# EAGLE design KLD35176BVIC_Panel_Test_Board (EAGLE 9.6.1)

## Sheet 1 of 3: LCD Circuitry
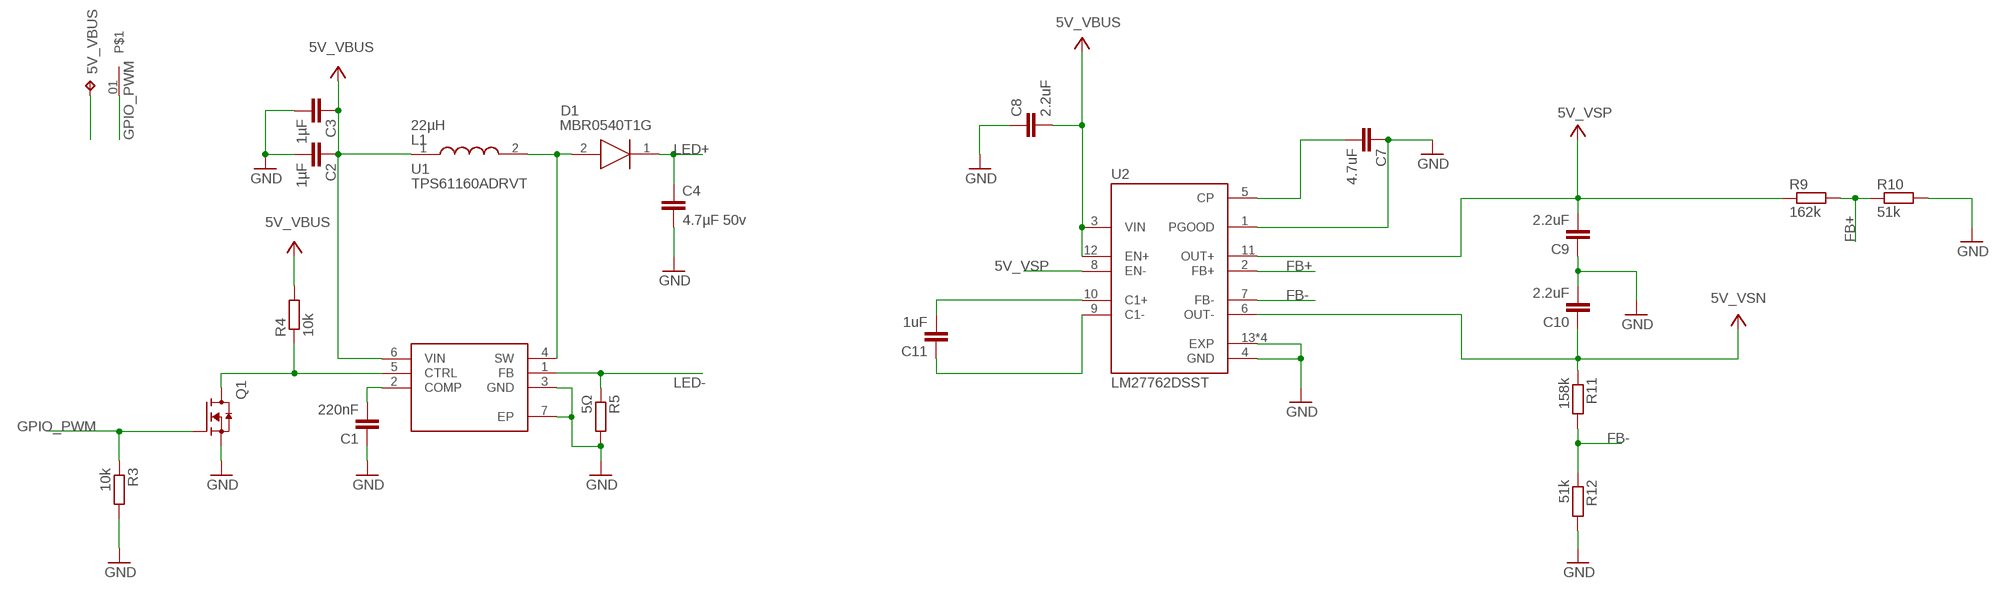
[diagram p0: schematic, sheet 1]

### Parts
5V_VBUS  TPTP19R  [TP19R]
C1  220nF  C-EUC0603  [C0603]
C2  1µF  C-EUC0603  [C0603]
C3  1µF  C-EUC0603  [C0603]
C4  4.7µF 50v  C-EUC0805  [C0805]
C7  4.7uF  C-EUC0603  [C0603]
C8  2.2uF  C-EUC0603  [C0603]
C9  2.2uF  C-EUC0603  [C0603]
C10  2.2uF  C-EUC0603  [C0603]
C11  1uF  C-EUC0603  [C0603]
D1  MBR0540T1G  [SOD3716X135N]
L1  22µH  VLCF4020T-220MR56  [VLCF4020_1]
Q1  AO3400A  [SOT95P280X125-3N]
R3  10k  R-EU_R0603  [R0603]
R4  10k  R-EU_R0603  [R0603]
R5  5Ω  R-EU_R0603  [R0603]
R9  162k  R-EU_R0603  [R0603]
R10  51k  R-EU_R0603  [R0603]
R11  158k  R-EU_R0603  [R0603]
R12  51k  R-EU_R0603  [R0603]
U1  TPS61160ADRVT  [SON65P200X200X80-7N]
U2  LM27762DSST  [IC_LM27762DSST]
U$1  PAD  [AMPHENOL_10129381-908001BLF]

### Nets
5V_VBUS: 5V_VBUS.TP C2.1 C3.1 C8.2 L1.1 R4.2 U1.6(VIN) U2.3(VIN) U2.12(EN+) ; supply symbol labelled +5V ; also sheet 3
5V_VSN: C10.1 R11.1 U2.6(OUT-) ; supply symbol labelled +5V ; also sheet 2
5V_VSP: C9.2 R9.1 U2.8(EN-) U2.11(OUT+) ; supply symbol labelled +5V ; also sheet 2
FB+: R9.2 R10.1 U2.2(FB+)
FB-: R11.2 R12.1 U2.7(FB-)
GND: C1.1 C2.2 C3.2 C4.2 C7.1 C8.1 C9.1 C10.2 Q1.2(S) R3.2 R5.2 R10.2 R12.2 U1.3(GND) U1.7(EP) U2.1(PGOOD) U2.4(GND) U2.13(EXP) U2.14(EXP) U2.15(EXP) U2.16(EXP) ; also sheet 2,3
GPIO_PWM: Q1.1(G) R3.1 U$1.01
LED+: C4.1 D1.1(K) ; also sheet 2
LED-: R5.1 U1.1(FB) ; also sheet 2
N$1: C1.2 U1.2(COMP)
N$2: D1.2(A) L1.2 U1.4(SW)
N$3: C7.2 U2.5(CP)
N$7: C11.2 U2.10(C1+)
N$8: C11.1 U2.9(C1-)
N$43: Q1.3(D) R4.1 U1.5(CTRL)

## Sheet 2 of 3: Connectors
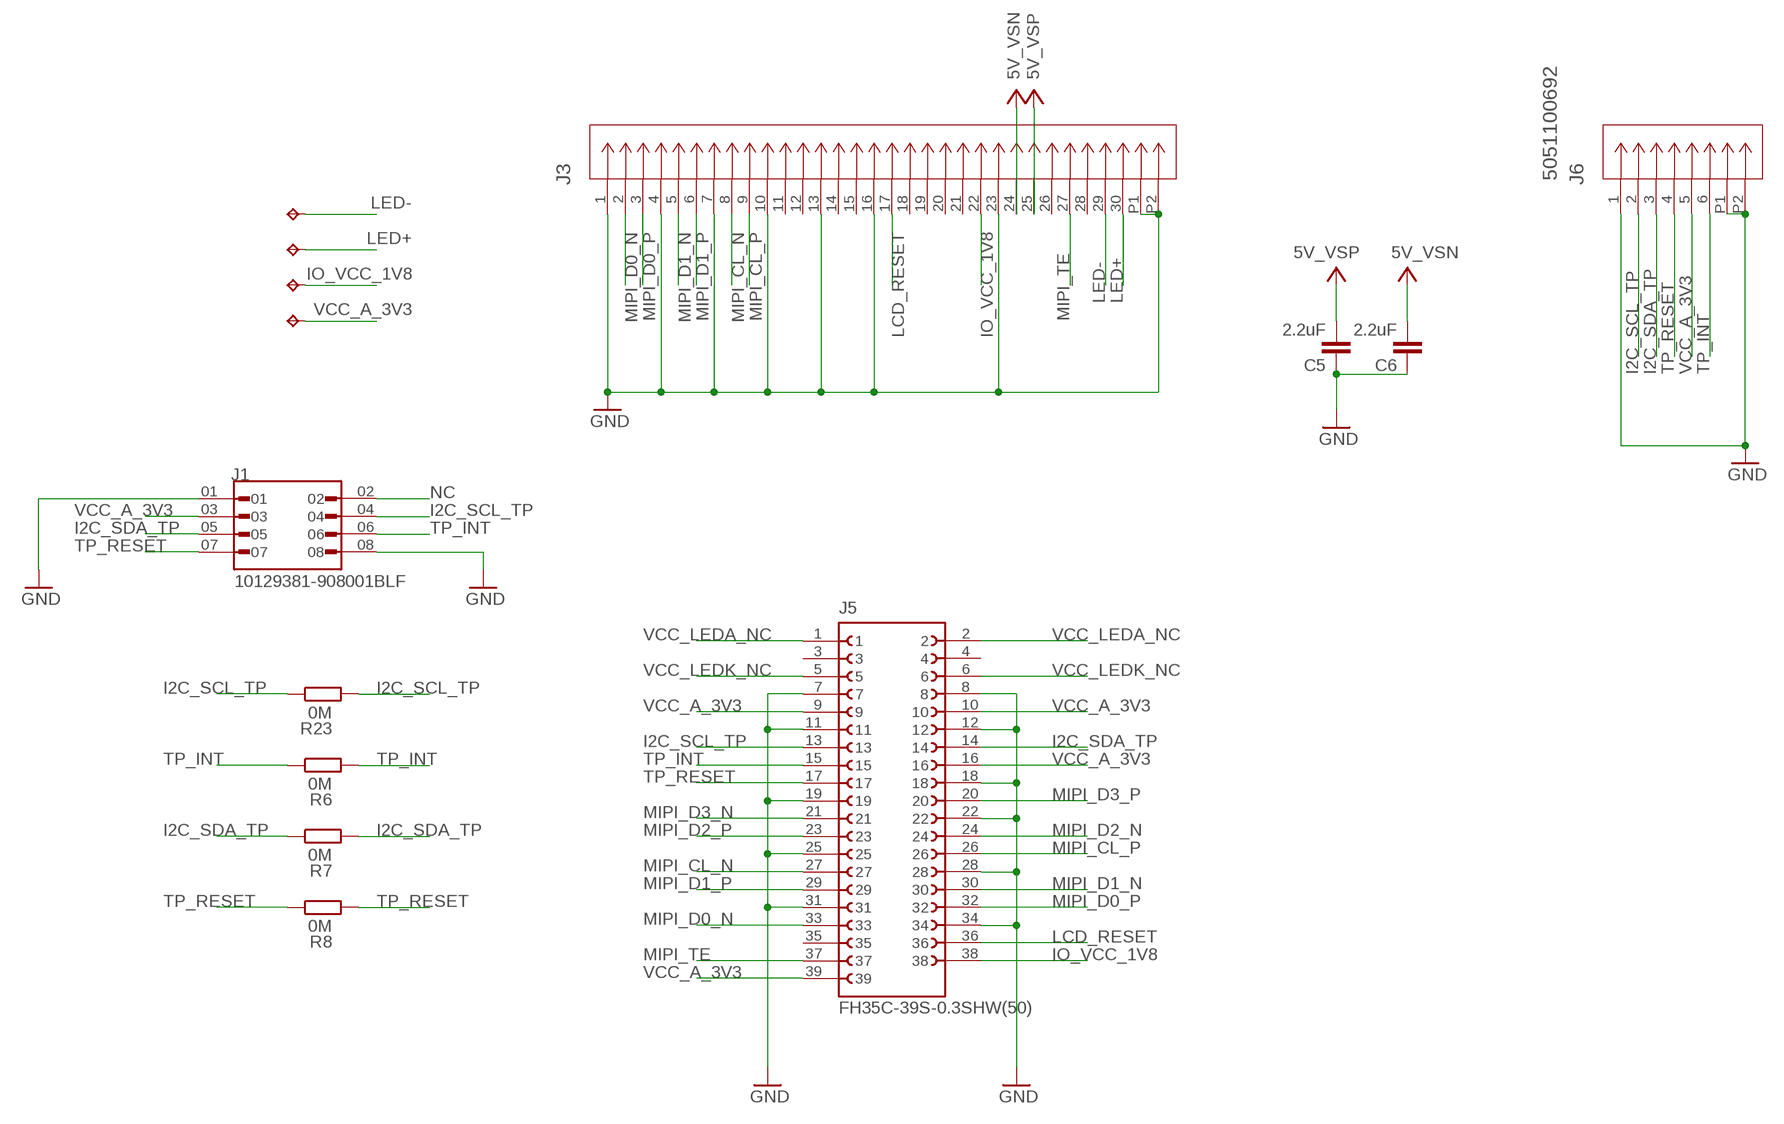
[diagram p1: schematic, sheet 2]

### Parts
C5  2.2uF  C-EUC0603  [C0603]
C6  2.2uF  C-EUC0603  [C0603]
IO_VCC_1V8  TPTP19R  [TP19R]
J1  10129381-908001BLF  [AMPHENOL_10129381-908001BLF]
J3  5051103091  [CON_5051103091_MOL]
J5  FH35C-39S-0.3SHW(50)  [HRS_FH35C-39S-0.3SHW(50)]
J6  5051100692  [CON_5051100692_MOL]
LED+  TPTP19R  [TP19R]
LED-  TPTP19R  [TP19R]
R6  0M  R-EU_R0402  [R0402]
R7  0M  R-EU_R0402  [R0402]
R8  0M  R-EU_R0402  [R0402]
R23  0M  R-EU_R0402  [R0402]
VCC_A_3V3  TPTP19R  [TP19R]

### Nets
5V_VSN: C6.2 J3.24 ; supply symbol labelled +5V ; also sheet 1
5V_VSP: C5.2 J3.25 ; supply symbol labelled +5V ; also sheet 1
GND: C5.1 C6.1 J1.01 J1.08 J3.1 J3.4 J3.7 J3.10 J3.13 J3.16 J3.23 J3.P1 J3.P2 J5.7 J5.8 J5.11 J5.12 J5.18 J5.19 J5.22 J5.25 J5.28 J5.31 J5.34 J6.1 J6.P1 J6.P2 ; also sheet 1,3
I2C_SCL_TP: J1.04 J5.13 J6.2 R23.1 R23.2
I2C_SDA_TP: J1.05 J5.14 J6.3 R7.1 R7.2
IO_VCC_1V8: IO_VCC_1V8.TP J3.22 J5.38
LCD_RESET: J3.17 J5.36
LED+: J3.30 LED+.TP ; also sheet 1
LED-: J3.29 LED-.TP ; also sheet 1
MIPI_CL_N [MIPI 100 Ohm]: J3.8 J5.27
MIPI_CL_P [MIPI 100 Ohm]: J3.9 J5.26
MIPI_D0_N [MIPI 100 Ohm]: J3.2 J5.33
MIPI_D0_P [MIPI 100 Ohm]: J3.3 J5.32
MIPI_D1_N [MIPI 100 Ohm]: J3.5 J5.30
MIPI_D1_P [MIPI 100 Ohm]: J3.6 J5.29
MIPI_D2_N [MIPI 100 Ohm]: J5.24
MIPI_D2_P [MIPI 100 Ohm]: J5.23
MIPI_D3_N [MIPI 100 Ohm]: J5.21
MIPI_D3_P [MIPI 100 Ohm]: J5.20
MIPI_TE: J3.27 J5.37
NC: J1.02
TP_INT: J1.06 J5.15 J6.6 R6.1 R6.2
TP_RESET: J1.07 J5.17 J6.4 R8.1 R8.2
VCC_A_3V3: J1.03 J5.9 J5.10 J5.16 J5.39 J6.5 VCC_A_3V3.TP
VCC_LEDA_NC: J5.1 J5.2
VCC_LEDK_NC: J5.5 J5.6
Unconnected: J3.11 J3.12 J3.14 J3.15 J3.18 J3.19 J3.20 J3.21 J3.26 J3.28 J5.3 J5.4 J5.35

## Sheet 3 of 3: USB-C Port
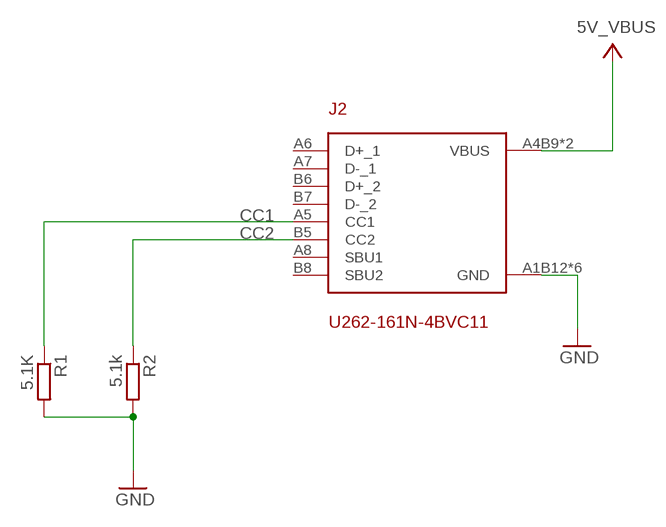
[diagram p2: schematic, sheet 3]

### Parts
J2  U262-161N-4BVC11  [U262-161N-4BVC11]
R1  5.1K  R-EU_R0603  [R0603]
R2  5.1k  R-EU_R0603  [R0603]

### Nets
5V_VBUS: J2.A4B9(VBUS) J2.B4A9(VBUS) ; supply symbol labelled VCC ; also sheet 1
CC1: J2.A5(CC1) R1.1
CC2: J2.B5(CC2) R2.1
GND: J2.A1B12(GND) J2.B1A12(GND) J2.SHIELD_1(GND) J2.SHIELD_2(GND) J2.SHIELD_3(GND) J2.SHIELD_4(GND) R1.2 R2.2 ; also sheet 1,2
Unconnected: J2.A6(D+_1) J2.A7(D-_1) J2.A8(SBU1) J2.B6(D+_2) J2.B7(D-_2) J2.B8(SBU2)

## Library data of the parts
5V_VBUS IO_VCC_1V8 LED+ LED- VCC_A_3V3 = testpad:TP: Test pad
C1-C11 = resistor:C-EU: CAPACITOR, European symbol
D1 = samacsys:MBR0540T1G: 0.5A 40V Schottky Rectifier, MBR0540T1G ON Semiconductor MBR0540T1G Schottky Diode, 0.5A, 40V, 2-Pin SOD-123 Source: Datasheet <http://www.onsemi.com/pub/Collateral/MBR0540T1-D.PDF>; ALLIED_NUMBER: 70099497; ALLIED_PRICE-STOCK: http://www.alliedelec.com/on-semiconductor-mbr0540t1g/70099497/; DESCRIPTION: 0.5A 40V Schottky Rectifier, MBR0540T1G ON Semiconductor MBR0540T1G Schottky Diode, 0.5A, 40V, 2-Pin SOD-123; HEIGHT: 1.35mm; MANUFACTURER_NAME: ON Semiconductor; MANUFACTURER_PART_NUMBER: MBR0540T1G; MOUSER_PART_NUMBER: 863-MBR0540T1G; MOUSER_PRICE-STOCK: https://www.mouser.com/Search/Refine.aspx?Keyword=863-MBR0540T1G; RS_PART_NUMBER: 0463842P; RS_PRICE-STOCK: http://uk.rs-online.com/web/p/products/0463842P
J1 = 10129381-908001BLF:10129381-908001BLF; MANUFACTURER: Amphenol ICC; PARTREV: D; STANDARD: Manufacturer Recommendations
J2 = gustl_U262-161N-4BVC11:U262-161N-4BVC11
J3 = 5051103091:5051103091; COPYRIGHT: Copyright (C) 2023 Ultra Librarian. All rights reserved.; MANUFACTURER_PART_NUMBER: 5051103091; MFR_NAME: Molex Connector Corporation
J5 = FH35C-39S-0.3SHW_50_:FH35C-39S-0.3SHW(50): Check availability <https://pricing.snapeda.com/parts/FH35C-39S-0.3SHW%2850%29/Hirose%20Electric/view-part?ref=eda>; AVAILABILITY: In Stock; CHECK_PRICES: https://www.snapeda.com/parts/FH35C-39S-0.3SHW(50)/Hirose/view-part/?ref=eda; DESCRIPTION: 39 Position FPC Connector Contacts, Top and Bottom 0.012 (0.30mm) Surface Mount, Right Angle; MF: Hirose Electric; MP: FH35C-39S-0.3SHW(50); PACKAGE: None; PRICE: None; PURCHASE-URL: https://www.snapeda.com/api/url_track_click_mouser/?unipart_id=561020&manufacturer=Hirose Electric&part_name=FH35C-39S-0.3SHW(50)&search_term=fh35c-39s-0.3shw(50); SNAPEDA_LINK: https://www.snapeda.com/parts/FH35C-39S-0.3SHW(50)/Hirose/view-part/?ref=snap
J6 = 5014610491:5051100692; COPYRIGHT: Copyright (C) 2026 Ultra Librarian. All rights reserved.; DATASHEET: https://www.molex.com/en-us/products/part-detail-pdf/5051100692?display=pdf; DESCRIPTION: Easy-On FFC/FPC Connector, 0.50mm Pitch, FD19 Series, Right-Angle, Bottom Contact, 1.90mm Height, 6 Circuits, Gold over Nickel Plating; MANUFACTURER_NAME: Molex Connector Corporation; MANUFACTURER_PART_NUMBER: 5051100692
L1 = samacsys:VLCF4020T-220MR56: TDK VLCF4020 Series Shielded Wire-wound SMD Inductor 22 uH +/-20% 800mA Idc Source: Datasheet <https://product.tdk.com/info/en/catalog/datasheets/inductor_commercial_power_vlcf4020_en.pdf>; DESCRIPTION: TDK VLCF4020 Series Shielded Wire-wound SMD Inductor 22 uH +/-20% 800mA Idc; HEIGHT: mm; MANUFACTURER_NAME: TDK; MANUFACTURER_PART_NUMBER: VLCF4020T-220MR56; MOUSER_PART_NUMBER: 810-VLCF4020T220MR56; MOUSER_PRICE-STOCK: https://www.mouser.com/Search/Refine.aspx?Keyword=810-VLCF4020T220MR56; RS_PART_NUMBER: 6442781; RS_PRICE-STOCK: https://uk.rs-online.com/web/p/products/6442781
Q1 = AO3400A:AO3400A: Trans MOSFET N-CH 30V 5.7A 3-Pin SOT-23; DESCRIPTION: N-Channel 30V 5.7A (Ta) 1.4W (Ta) Surface Mount SOT-23-3L; DIGI-KEY_PART_NUMBER: 785-1000-1-ND; MF: Alpha &; MP: AO3400A; PACKAGE: SOT-23 Alpha &amp; Omega Semiconductor
R1-R12 R23 = rcl:R-EU_: RESISTOR, European symbol; SPICEPREFIX: R
U1 = samacsys:TPS61160ADRVT: White LED Driver with PWM Brightness Control in 2mm x 2mm Package. Up to 10 LEDs in Series Source: Datasheet <http://www.ti.com/lit/ds/symlink/tps61160a.pdf>; DESCRIPTION: White LED Driver with PWM Brightness Control in 2mm x 2mm Package. Up to 10 LEDs in Series; HEIGHT: 0.8mm; MANUFACTURER_NAME: Texas Instruments; MANUFACTURER_PART_NUMBER: TPS61160ADRVT; MOUSER_PART_NUMBER: 595-TPS61160ADRVT; MOUSER_PRICE-STOCK: https://www.mouser.com/Search/Refine.aspx?Keyword=595-TPS61160ADRVT; RS_PART_NUMBER: 7099044P; RS_PRICE-STOCK: http://uk.rs-online.com/web/p/products/7099044P
U2 = LM27762DSST:LM27762DSST: Check availability <https://pricing.snapeda.com/parts/LM27762DSST/Texas%20Instruments/view-part?ref=eda>; AVAILABILITY: In Stock; CHECK_PRICES: https://www.snapeda.com/parts/LM27762DSST/Texas+Instruments/view-part/?ref=eda; DESCRIPTION: Low-Noise Positive- and Negative-Output Charge Pump With Integrated LDO; MF: Texas Instruments; MP: LM27762DSST; PACKAGE: WSON-12 Texas Instruments; PRICE: None; SNAPEDA_LINK: https://www.snapeda.com/parts/LM27762DSST/Texas+Instruments/view-part/?ref=snap
U$1 = PAD 2.54:PAD

## Net classes
1 USB 2.0 Differential Pair: width 0.192 mm, clearance 0.114 mm
2 MIPI 100 Ohm: width 0.124 mm, clearance 0.114 mm

## Board
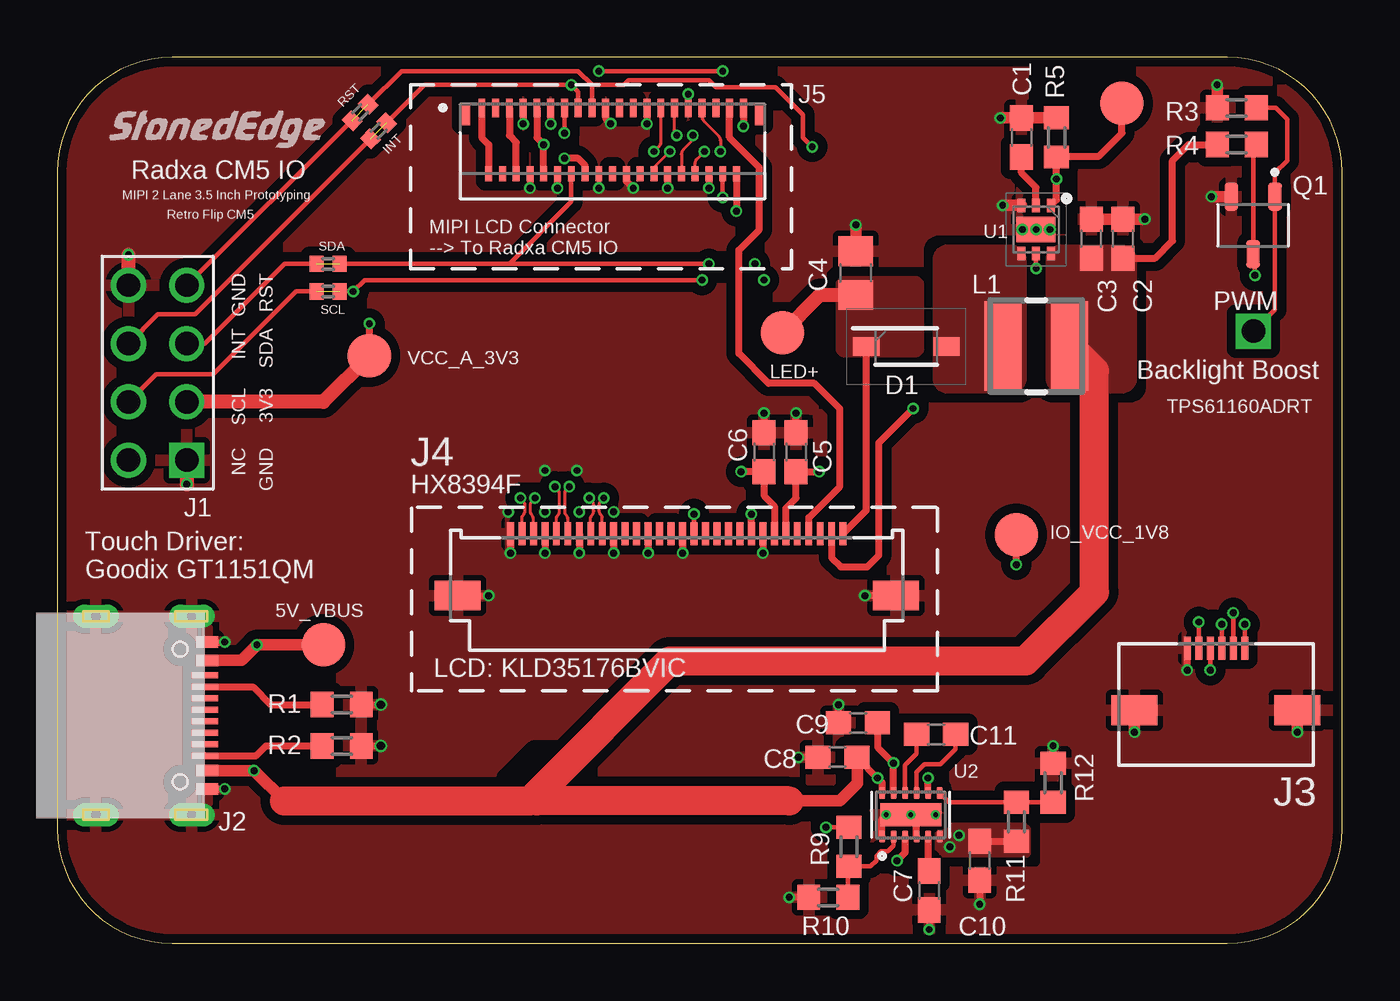
[diagram p3: board, top side]
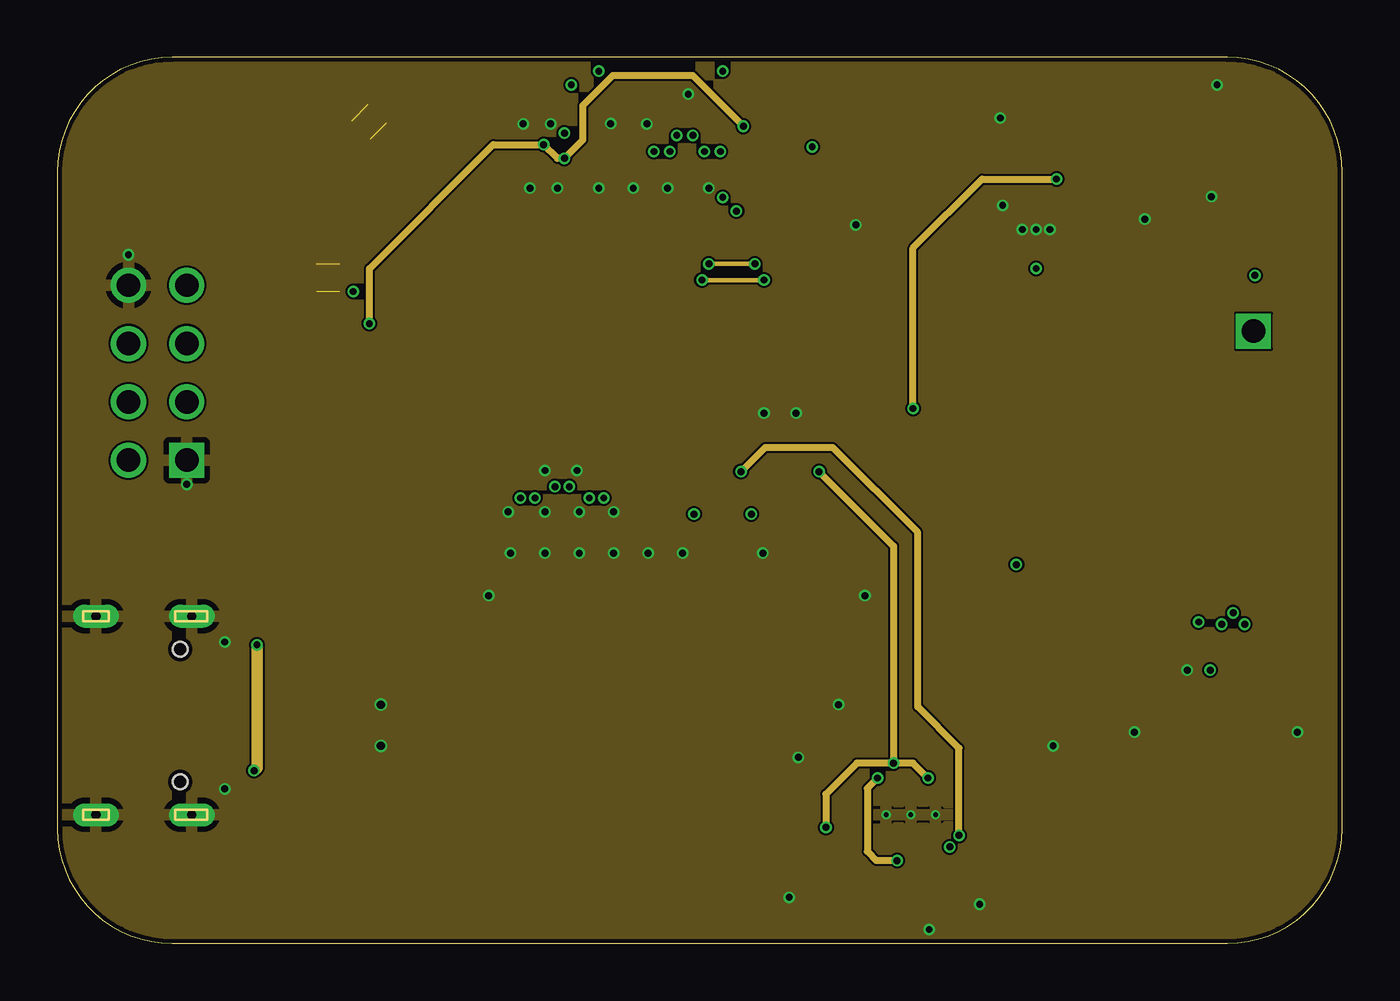
[diagram p4: board, inner layer Route2]
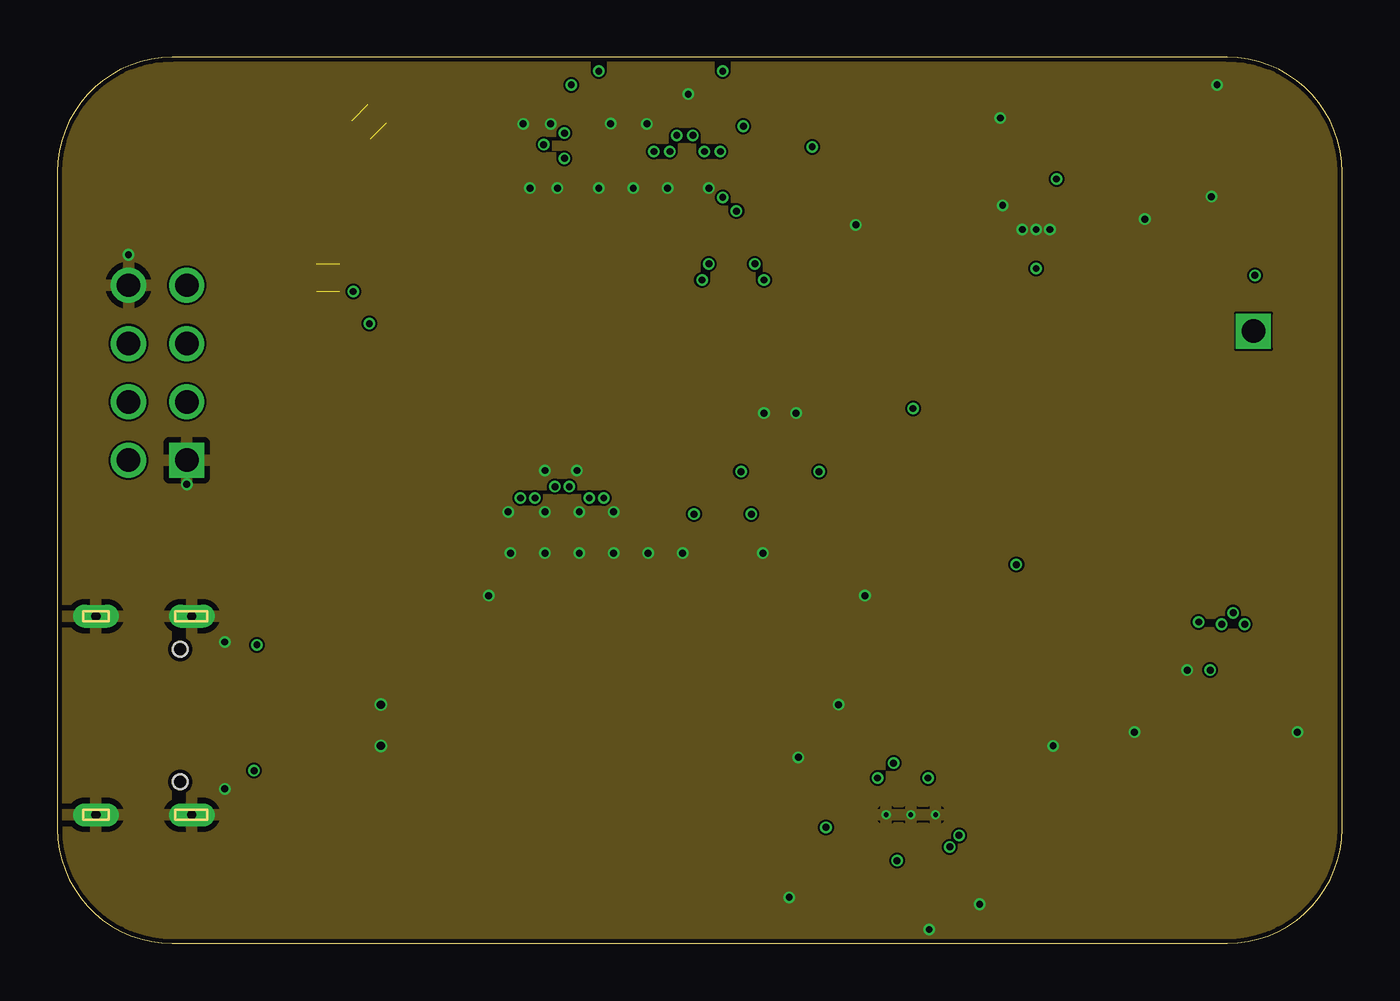
[diagram p5: board, inner layer Route15]
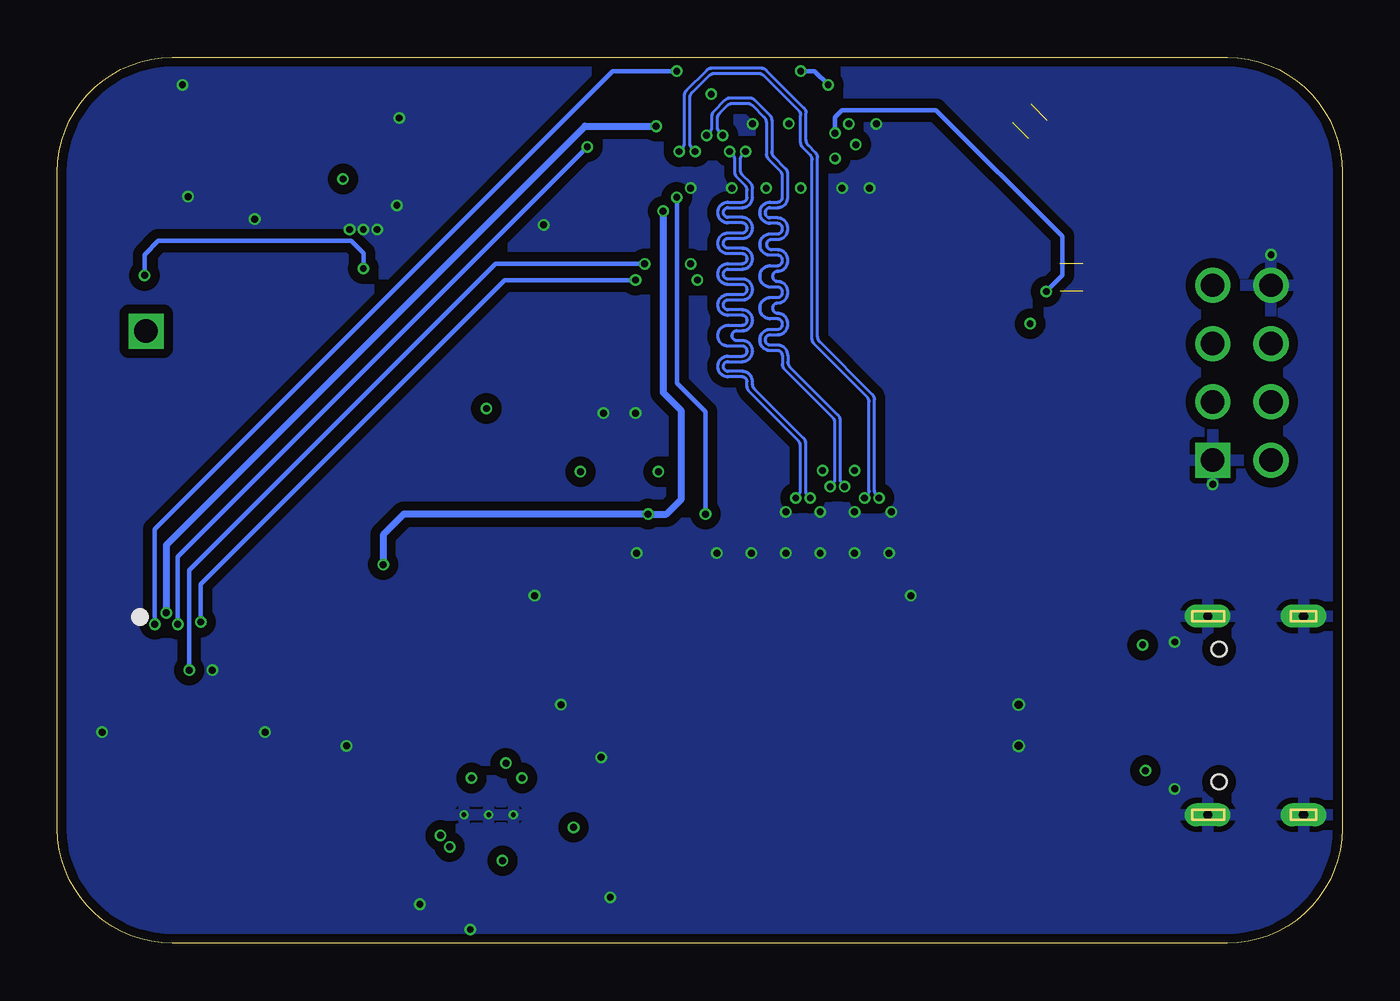
[diagram p6: board, bottom side, seen from below]

Size 56 x 38.6 mm. Coordinates in mm from the lower left corner, seen from the top.
Outline: 0,33.6 0,5 arc90 5,0 51,0 arc90 56,5 56,33.6 arc90 51,38.6 5,38.6 arc90 0,33.6
Copper layers (1+2*15+16): Top 0.035mm / dielectric 0.2104mm / Route2 0.0152mm / dielectric 1.065mm / Route15 0.0152mm / dielectric 0.2104mm / Bottom 0.035mm
Design rules "default *": minimum track width 3.5mil, minimum drill 0.2mm, track to track 3.5mil, track to pad 3.5mil, pad to pad 3.5mil, via to via 5mil, smd to smd 0mil, copper to edge 0.2mm, drill to drill 5mil, minimum pad ring 4mil, minimum via ring 4mil, stop-mask expansion 0mil, vias tented up to drill 100mil, thermal gap 10mil
tRestrict: area 42.8,31.4 to 44,37.6; area 19.6,6.6 to 21.4,8.4

### Footprints (pad centres in the part's own frame; a part is rotated, then mirrored left to right if it is on the bottom)
TP19R = smd 1.9 x 1.9: TP 0,0
C0603 = smd 1.1 x 1: 1 -0.85,0; 2 0.85,0
C0805 = smd 1.3 x 1.5: 1 -0.95,0; 2 0.95,0
SOD3716X135N = smd 1.15 x 0.8: 1 -1.75,0; 2 1.75,0
AMPHENOL_10129381-908001BLF = drill 1.02 pad 1.53 square: 01 -3.81,-1.27 | drill 1.02 pad 1.53: 02 -3.81,1.27; 03 -1.27,-1.27; 04 -1.27,1.27; 05 1.27,-1.27; 06 1.27,1.27; 07 3.81,-1.27; 08 3.81,1.27
U262-161N-4BVC11 = smd 0.5 x 0.95: A1B12 -3.2,7.455; A4B9 -2.4,7.455; B1A12 3.2,7.455; B4A9 2.4,7.455 | smd 0.25 x 1.15: A5 -1.25,7.355; A6 -0.25,7.355; A7 0.25,7.355; A8 1.25,7.355; B5 1.75,7.355; B6 0.75,7.355; B7 -0.75,7.355; B8 -1.75,7.355 | drill 0.4 pad 1 long: SHIELD_1 -4.325,6.78; SHIELD_2 -4.325,2.6; SHIELD_3 4.325,6.78; SHIELD_4 4.325,2.6 | hole 0.65: -2.89,6.28; 2.89,6.28
CON_5051103091_MOL = smd 0.3 x 1: 1 -7.25,2.45; 2 -6.75,2.45; 3 -6.25,2.45; 4 -5.75,2.45; 5 -5.25,2.45; 6 -4.75,2.45; 7 -4.25,2.45; 8 -3.75,2.45; 9 -3.25,2.45; 10 -2.75,2.45; 11 -2.25,2.45; 12 -1.75,2.45; 13 -1.25,2.45; 14 -0.75,2.45; 15 -0.25,2.45; 16 0.25,2.45; 17 0.75,2.45; 18 1.25,2.45; 19 1.75,2.45; 20 2.25,2.45; 21 2.75,2.45; 22 3.25,2.45; 23 3.75,2.45; 24 4.25,2.45; 25 4.75,2.45; 26 5.25,2.45; 27 5.75,2.45; 28 6.25,2.45; 29 6.75,2.45; 30 7.25,2.45 | smd 2 x 1.3: P1 -9.55,-0.25; P2 9.55,-0.25
HRS_FH35C-39S-0.3SHW(50) = smd 0.3 x 0.8: 1 5.7,-1.4; 3 5.1,-1.4; 5 4.5,-1.4; 7 3.9,-1.4; 9 3.3,-1.4; 11 2.7,-1.4; 13 2.1,-1.4; 15 1.5,-1.4; 17 0.9,-1.4; 19 0.3,-1.4; 21 -0.3,-1.4; 23 -0.9,-1.4; 25 -1.5,-1.4; 27 -2.1,-1.4; 29 -2.7,-1.4; 31 -3.3,-1.4; 33 -3.9,-1.4; 35 -4.5,-1.4; 37 -5.1,-1.4; 39 -5.7,-1.4 | smd 0.3 x 0.65: 2 5.4,1.475; 4 4.8,1.475; 6 4.2,1.475; 8 3.6,1.475; 10 3,1.475; 12 2.4,1.475; 14 1.8,1.475; 16 1.2,1.475; 18 0.6,1.475; 20 0,1.475; 22 -0.6,1.475; 24 -1.2,1.475; 26 -1.8,1.475; 28 -2.4,1.475; 30 -3,1.475; 32 -3.6,1.475; 34 -4.2,1.475; 36 -4.8,1.475; 38 -5.4,1.475 | smd 0.4 x 0.95: S1 6.4,-1.125; S2 -6.4,-1.125
CON_5051100692_MOL = smd 0.3 x 1: 1 -1.25,2.45; 2 -0.75,2.45; 3 -0.25,2.45; 4 0.25,2.45; 5 0.75,2.45; 6 1.25,2.45 | smd 2 x 1.3: P1 -3.55,-0.25; P2 3.55,-0.25
VLCF4020_1 = smd 3.9 x 1.6: 1 0,-1.45; 2 0,1.45
SOT95P280X125-3N = smd 1.21 x 0.59: 1 -1.255,0.95; 2 -1.255,-0.95; 3 1.255,0
R0603 = smd 1 x 1.1: 1 -0.85,0; 2 0.85,0
R0402 = smd 0.6 x 0.7: 1 -0.5,0; 2 0.5,0
SON65P200X200X80-7N = smd 0.6 x 0.35: 1 -1.05,0.65; 2 -1.05,0; 3 -1.05,-0.65; 4 1.05,-0.65; 5 1.05,0; 6 1.05,0.65 | smd 1.1 x 1.7: 7 0,0
IC_LM27762DSST = smd 0.5 x 0.25: 1 -0.95,1.25; 2 -0.95,0.75; 3 -0.95,0.25; 4 -0.95,-0.25; 5 -0.95,-0.75; 6 -0.95,-1.25; 7 0.95,-1.25; 8 0.95,-0.75; 9 0.95,-0.25; 10 0.95,0.25; 11 0.95,0.75; 12 0.95,1.25 | smd 1 x 2.65: 13 0,0 | drill 0.2 pad 0.4: 14 0,1.075; 15 0,0; 16 0,-1.075
AMPHENOL_10129381-908001BLF' = drill 1.02 pad 1.53 square: 01 -3.81,-1.27

### Placement (x,y rotation side)
5V_VBUS  11.6,13 180 top
C1  42.02,35.11 270 top
C2  46.45,30.7 90 top
C3  45.07,30.7 90 top
C4  34.8,29.2 90 top
C5  32.2,21.4 270 top
C6  30.8,21.4 270 top
C7  38,2.3 90 top
C8  34,8.1 0 top
C9  34.9,9.6 0 top
C10  40.2,3.6 270 top
C11  38.3,9.1 180 top
D1  37,26 0 top
IO_VCC_1V8  41.8,17.8 0 top
J1  4.37,24.86 90 top
J2  -0.92,9.93 270 top
J3  27,15.4 0 top
J5  24.2,35 180 top
J6  50.5,10.4 0 top
L1  42.66,26.02 90 top
LED+  31.6,26.6 0 top
LED-  46.4,36.6 0 top
Q1  52.12,31.28 270 top
R1  12.4,10.4 0 top
R2  12.4,8.6 0 top
R3  51.4,36.4 180 top
R4  51.4,34.8 180 top
R5  43.55,35.11 90 top
R6  14,35.4 45 top
R7  11.8,29.6 0 top
R8  13.2,36.2 45 top
R9  34.5,4.2 270 top
R10  33.6,2 180 top
R11  41.8,5.3 90 top
R12  43.4,7 90 top
R23  11.8,28.4 0 top
U1  42.66,31.1 270 top
U2  37.2,5.6 90 top
U$1  PAD  [AMPHENOL_10129381-908001BLF']  55.94,27.94 0 top
VCC_A_3V3  13.6,25.6 0 top

### Tracks (layer width: path | path; a pad name or v marks a point on that pad's centre or on a via)
5V_VBUS  (via drill 0.3)
  Top 0.305: U2.3 36.95,3.95 v36.6,3.6 | U2.12 35.95,7 v35.75,7.2 34.88,8.07 C8.2 | C2.1 47.85,29.85 48.6,30.6 48.6,34.1 49.3,34.8 R4.2
  Top 0.508: J2.A4B9 8.02,12.32 v8.7,13 5V_VBUS.TP | J2.B4A9 v8.57,7.53 9.9,6.2 | 23.7,6.2 31.9,6.2 34.1,6.2 34.88,6.97 34.88,8.07
  Top 0.813: 20.6,6.2 26.7,12.3
  Top 1.27: 9.9,6.2 20.6,6.2 20.9,6.2 | 31.9,6.2 20.9,6.2 | 20.9,6.2 20.9,6.5 26.7,12.3 42.2,12.3 45.2,15.3 45.2,24.93 L1.1
  Route2 0.305: v36.6,3.6 35.7,3.6 35.3,4 35.3,6.75 v35.75,7.2
  Route2 0.508: v8.7,13 8.7,7.65 v8.57,7.53
  pour Top (no thermals): 46.37,24 43.76,24 arc-90 43.13,24.64 43.13,29.77 arc-90 43.76,30.4 46.37,30.4 arc-90 47,29.77 47,24.64 arc-90
5V_VSN  (via drill 0.3)
  Top 0.305: C10.1 R11.1 | J3.24 31.25,19.05 30.8,19.5 C6.2 v29.8,20.55
  Route2 0.305: v39.3,4.7 39.3,8.5 37.5,10.3 37.5,17.9 33.8,21.6 30.85,21.6 v29.8,20.55
  other vias: 38.9,4.2
  pour Top (no thermals): 38.3,4.8 38.3,4.1 38.5,3.9 38.6,3.8 42.3,3.8 42.4,3.9 42.4,5 42.3,5.1 42.2,5.2 39,5.2 38.9,5.1 38.7,4.9 38.4,4.9
5V_VSP  (via drill 0.3)
  Top 0.203: R9.1 v33.5,5.05
  Top 0.305: C9.2 35.75,8.55 v36.45,7.85 U2.11 | U2.8 v37.95,7.2 | J3.25 31.75,18.95 32.2,19.4 C5.2 v33.2,20.55
  Route2 0.305: v37.95,7.2 37.3,7.85 v36.45,7.85 | v33.2,20.55 36.45,17.3 v36.45,7.85 | v36.45,7.85 34.85,7.85 33.5,6.5 v33.5,5.05
CC1
  Top 0.305: J2.A5 8.52,11.18 9.3,10.4 R1.1
CC2
  Top 0.305: R2.1 9.1,8.6 8.68,8.18 J2.B5
FB+
  Top 0.203: R10.1 34.45,3.3 R9.2 35.45,3.35 35.7,3.6 35.7,3.8 35.9,4 36.2,4 36.45,4.25 U2.2
FB-
  Top 0.203: R12.1 R11.2 38.85,6.15 U2.7
GND  (via drill 0.3, 0.35)
  Top 0.203: J5.18 v23.6,32.9
  Top 0.305: J5.7 v20.3,35.7 | J5.11 v21.5,35.7 | J5.8 v20.6,32.9 | v21.8,32.9 J5.12 | J5.28 v26.6,32.9 | J5.34 v28.4,32.9 | v49.25,11.9 J6.1 | R1.2 v14.1,10.4 | R2.2 v14.1,8.6 | R10.2 v31.9,2 | C10.2 v40.2,1.7 | C9.1 v34.05,10.4 | C8.1 v32.3,8.1 | C7.1 v38,0.6 | U2.1 35.95,5.42 U2.14 U2.15 | U2.4 37.45,5.35 U2.15 | U2.15 U2.16 | R12.2 v43.4,8.6 | v30.8,23.1 C6.1 | C5.1 v32.2,23.1 | J3.4 v21.25,17 | J3.1 v19.75,17 | J3.7 v22.75,17 | J3.10 v24.25,17 | J3.13 v25.75,17 | J3.16 v27.25,17 | J3.23 v30.75,17 | J3.P1 v18.8,15.15 | J3.P2 v35.2,15.15 | J2.B1A12 v7.3,6.72 | J2.A1B12 v7.3,13.12 | J5.22 24.8,33.2 v25.1,32.9 | J5.25 v25.7,35.7 | J5.19 23.9,35.93 v24.12,35.72 | J5.31 v27.5,37
  Top 0.508: C4.2 v34.8,31.3 | C3.2 C2.2 v47.4,31.55 | U1.3 v41.2,32.15 | Q1.2 v50.3,32.53 | R3.2 v50.55,37.4 | R5.2 C1.1 v41.1,35.96 | J6.P1 v46.95,9.2 | J6.P2 v54.05,9.2
  Top 0.61: J1.01 v5.64,20 | J1.08 v3.1,30
  other vias: 42.66,31.1 42.06,31.1 43.26,31.1 22.75,18.8 24.25,18.8 22.65,20.6 21.25,20.6 21.25,18.8 19.65,18.8
  pour Bottom (isolate 0.406, rank 2): -3,40.3 -3,-2 55.5,-2 55.5,40.3
  pour Top (isolate 0.406, rank 2): -4.5,42.2 -4.5,-3.7 57.3,-3.7 57.3,42.2
  pour Route15: -6.4,44 -6.4,-5.6 59.2,-5.6 59.2,44
  pour Route2: -8.4,46 -8.4,-7.6 61,-7.6 61,46
GPIO_PWM
  Top 0.203: U$1.01 53.07,27.61 Q1.1 53.07,33.57 53.6,34.1 53.6,35.9 53.1,36.4 R3.1
I2C_SCL_TP  (via drill 0.3)  (1 unrouted)
  Top 0.203: R23.1 10.4,28.4 6.8,24.8 4.31,24.8 J1.04 | J5.13 v22.1,35.3 | J6.2 v49.75,14 | R23.2 v12.9,28.4 13.4,28.9 v28.1,28.9
  Route2 0.203: v30.8,28.9 v28.1,28.9
  Bottom 0.203: v12.9,28.4 12.2,29.1 12.2,30.8 17.7,36.3 21.8,36.3 22.1,36 v22.1,35.3 | v30.8,28.9 36.5,28.9 49.75,15.65 v49.75,14
I2C_SDA_TP  (via drill 0.3)  (1 unrouted)
  Top 0.203: J1.05 6.43,26.13 9.9,29.6 R7.1 | J6.3 v50.25,11.9 | R7.2 19.7,29.6 | J5.14 22.4,32.3 19.7,29.6 | 19.7,29.6 v28.4,29.6
  Route2 0.203: v28.4,29.6 v30.4,29.6
  Bottom 0.203: v30.4,29.6 36.9,29.6 50.25,16.25 v50.25,11.9
IO_VCC_1V8  (via drill 0.3)
  Top 0.305: J3.22 v30.25,18.7 | J5.38 v29.6,31.9 | v41.8,16.5 IO_VCC_1V8.TP
  Bottom 0.305: v29.6,31.9 29.6,24 28.8,23.2 28.8,19.35 29.45,18.7 v30.25,18.7 40.9,18.7 IO_VCC_1V8.TP v41.8,16.5
LCD_RESET  (via drill 0.3)
  Top 0.203: J5.36 v29,32.5 | J3.17 v27.75,18.7
  Bottom 0.203: v29,32.5 29,24.4 27.75,23.15 v27.75,18.7
LED+
  Top 0.305: D1.1 35.25,18.85 J3.30
  Top 0.61: LED+.TP 33.25,28.25 C4.1
  pour Top (no thermals): 37.39,29 34.32,29 arc90 34,28.68 34,25.92 arc90 34.32,25.6 37.39,25.6 arc90 37.71,25.92 37.71,28.68 arc90
LED-  (via drill 0.3)
  Top 0.305: J3.29 33.75,16.8 34.15,16.4 35.3,16.4 35.8,16.9 35.8,21.8 v37.3,23.3 | U1.1 43.55,32.39 v43.55,33.3 R5.1 43.59,34.3 45.4,34.3 46.4,35.3 LED-.TP
  Route2 0.305: v37.3,23.3 37.3,30.3 40.3,33.3 v43.55,33.3
MIPI_CL_N  (via drill 0.3)
  Top 0.124: J5.27 26.3,34.93 arc-45 26.21,34.71 v26,34.5 | J3.8 23.25,18.54 arc-45 23.29,18.64 arc45 23.38,18.86 23.38,19.07 arc45 23.29,19.3 v23.19,19.4
  Bottom 0.124: v26,34.5 26.14,34.36 arc-45 26.23,34.14 26.23,33.7 arc-45 26.14,33.48 25.79,33.13 arc45 25.7,32.91 25.7,32.5 arc90 26.14,32.06 26.77,32.06 arc-90 26.97,31.85 26.97,31.83 arc-90 26.77,31.62 26.14,31.62 arc90 25.7,31.18 25.7,31.16 arc90 26.14,30.71 26.77,30.71 arc-90 26.97,30.51 26.97,30.49 arc-90 26.77,30.28 26.14,30.28 arc90 25.7,29.84 25.7,29.82 arc90 26.14,29.37 26.77,29.37 arc-90 26.97,29.17 26.97,29.15 arc-90 26.77,28.94 26.14,28.94 arc90 25.7,28.5 25.7,28.48 arc90 26.14,28.03 26.77,28.03 arc-90 26.97,27.83 26.97,27.8 arc-90 26.77,27.6 26.14,27.6 arc90 25.7,27.16 25.7,27.13 arc90 26.14,26.69 26.38,26.69 arc-90 26.59,26.49 26.59,26.46 arc-90 26.38,26.26 26.14,26.26 arc90 25.7,25.82 25.7,25.79 arc90 26.14,25.35 26.77,25.35 arc-90 26.97,25.14 26.97,25.12 arc-90 26.77,24.92 26.14,24.92 arc90 25.7,24.47 25.7,24.37 arc-45 25.61,24.14 23.47,22.01 arc45 23.38,21.79 23.38,19.73 arc-45 23.29,19.5 v23.19,19.4
MIPI_CL_P  (via drill 0.3)
  Top 0.124: J5.26 26,33.67 arc-45 26.09,33.89 v26.7,34.5 | J3.9 23.75,18.54 arc45 23.71,18.64 arc-45 23.62,18.86 23.62,19.07 arc-45 23.71,19.3 v23.81,19.4
  Bottom 0.124: v26.7,34.5 26.56,34.36 arc45 26.47,34.14 26.47,33.6 arc-45 26.38,33.38 26.03,33.03 arc45 25.94,32.81 25.94,32.5 arc90 26.14,32.3 26.77,32.3 arc-90 27.21,31.85 27.21,31.83 arc-90 26.77,31.39 26.14,31.39 arc90 25.94,31.18 25.94,31.16 arc90 26.14,30.95 26.77,30.95 arc-90 27.21,30.51 27.21,30.49 arc-90 26.77,30.04 26.14,30.04 arc90 25.94,29.84 25.94,29.82 arc90 26.14,29.61 26.77,29.61 arc-90 27.21,29.17 27.21,29.15 arc-90 26.77,28.7 26.14,28.7 arc90 25.94,28.5 25.94,28.48 arc90 26.14,28.27 26.77,28.27 arc-90 27.21,27.83 27.21,27.8 arc-90 26.77,27.36 26.14,27.36 arc90 25.94,27.16 25.94,27.13 arc90 26.14,26.93 26.77,26.93 arc-90 27.21,26.49 27.21,26.46 arc-90 26.77,26.02 26.14,26.02 arc90 25.94,25.82 25.94,25.79 arc90 26.14,25.59 26.77,25.59 arc-90 27.21,25.14 27.21,25.12 arc-90 26.77,24.68 26.14,24.68 arc90 25.94,24.47 25.94,24.27 arc-45 25.84,24.05 23.71,21.91 arc45 23.62,21.69 23.62,19.73 arc45 23.71,19.5 v23.81,19.4
MIPI_D0_N  (via drill 0.3)
  Top 0.124: J5.33 28.1,36.03 arc45 28.19,35.81 28.81,35.19 arc-45 28.9,34.97 v28.9,34.5 | J3.2 20.25,18.54 arc-45 20.29,18.64 arc45 20.38,18.86 20.38,19.07 arc45 20.29,19.3 v20.18,19.4
  Bottom 0.124: v28.9,34.5 28.76,34.64 arc-45 28.67,34.86 28.67,36.94 arc45 28.58,37.16 27.69,38.05 arc45 27.47,38.14 25.33,38.14 arc45 25.11,38.05 23.45,36.39 arc45 23.36,36.17 23.36,34.99 arc-45 23.27,34.77 22.95,34.45 arc45 22.86,34.23 22.86,26.43 arc-45 22.77,26.21 20.47,23.91 arc45 20.38,23.69 20.38,19.73 arc-45 20.29,19.5 v20.18,19.4
MIPI_D0_P  (via drill 0.3)
  Top 0.124: J5.32 27.8,33.97 arc-45 27.89,34.19 v28.2,34.5 | J3.3 20.75,18.47 arc45 20.66,18.69 arc-45 20.62,18.78 20.62,19.07 arc-45 20.71,19.3 v20.82,19.4
  Bottom 0.124: v28.2,34.5 28.34,34.64 arc45 28.43,34.86 28.43,36.84 arc45 28.34,37.06 27.59,37.81 arc45 27.37,37.9 25.43,37.9 arc45 25.21,37.81 23.69,36.29 arc45 23.6,36.07 23.6,34.9 arc-45 23.51,34.67 23.19,34.36 arc45 23.1,34.13 23.1,26.33 arc-45 23.01,26.11 20.71,23.81 arc45 20.62,23.59 20.62,19.73 arc45 20.71,19.5 v20.82,19.4
MIPI_D1_N  (via drill 0.3)
  Top 0.124: v27.7,35.2 27.7,35.13 arc-45 27.61,34.91 27.29,34.59 arc45 27.2,34.37 27.2,33.6 | J3.5 21.75,18.47 arc-45 21.84,18.69 arc45 21.88,18.78 21.88,19.57 arc45 21.79,19.8 v21.69,19.9
  Top 0.152: 27.2,33.6 J5.30
  Bottom 0.124: v21.69,19.9 21.79,20 arc45 21.88,20.23 21.88,22.79 arc-45 21.97,23.01 24.07,25.11 arc45 24.16,25.33 24.16,25.62 arc-90 24.6,26.06 24.93,26.06 arc90 25.14,26.27 25.14,26.31 arc90 24.93,26.52 24.6,26.52 arc-90 24.16,26.96 24.16,27 arc-90 24.6,27.45 arc90 24.81,27.65 24.81,27.7 arc90 24.6,27.9 arc-90 24.16,28.34 24.16,28.39 arc-90 24.6,28.83 arc90 24.81,29.04 24.81,29.08 arc90 24.6,29.29 arc-90 24.16,29.73 24.16,29.77 arc-90 24.6,30.22 24.87,30.22 arc90 25.07,30.42 25.07,30.47 arc90 24.87,30.67 24.6,30.67 arc-90 24.16,31.11 24.16,31.16 arc-90 24.6,31.6 24.93,31.6 arc90 25.14,31.81 25.14,31.85 arc90 24.93,32.06 24.6,32.06 arc-90 24.16,32.5 24.16,33.53 arc-45 24.26,33.76 24.77,34.27 arc45 24.86,34.49 24.86,35.87 arc-45 24.95,36.09 25.61,36.74 arc-45 25.83,36.84 26.67,36.84 arc-45 26.89,36.74 27.38,36.26 arc-45 27.47,36.04 27.47,35.56 arc45 27.56,35.34 v27.7,35.2
MIPI_D1_P  (via drill 0.3)
  Top 0.124: v27,35.2 26.9,35.3 J5.29 | J3.6 22.25,18.47 arc45 22.16,18.69 arc-45 22.12,18.78 22.12,19.57 arc-45 22.21,19.8 v22.31,19.9
  Bottom 0.124: v22.31,19.9 22.21,20 arc-45 22.12,20.23 22.12,22.69 arc-45 22.21,22.91 24.31,25.01 arc45 24.4,25.23 24.4,25.62 arc-90 24.6,25.82 24.93,25.82 arc90 25.37,26.27 25.37,26.31 arc90 24.93,26.75 24.6,26.75 arc-90 24.4,26.96 24.4,27 arc-90 24.6,27.21 24.93,27.21 arc90 25.37,27.65 25.37,27.7 arc90 24.93,28.14 24.6,28.14 arc-90 24.4,28.34 24.4,28.39 arc-90 24.6,28.59 24.93,28.59 arc90 25.37,29.04 25.37,29.08 arc90 24.93,29.52 24.6,29.52 arc-90 24.4,29.73 24.4,29.77 arc-90 24.6,29.98 24.93,29.98 arc90 25.37,30.42 25.37,30.47 arc90 24.93,30.91 24.6,30.91 arc-90 24.4,31.11 24.4,31.16 arc-90 24.6,31.36 24.93,31.36 arc90 25.37,31.81 25.37,31.85 arc90 24.93,32.3 24.6,32.3 arc-90 24.4,32.5 24.4,33.43 arc-45 24.49,33.66 25.01,34.17 arc45 25.1,34.4 25.1,35.77 arc-45 25.19,35.99 25.71,36.51 arc-45 25.93,36.6 26.57,36.6 arc-45 26.79,36.51 27.14,36.16 arc-45 27.23,35.94 27.23,35.56 arc-45 27.14,35.34 v27,35.2
MIPI_TE
  Top 0.305: J3.27 32.75,18.55 34.1,19.9 34.1,23.3 33,24.4 31,24.4 29.7,25.7 29.7,30.2 30.6,31.1 30.6,33.8 29.3,35.1 J5.37
N$1
  Top 0.305: U1.2 42.66,32.94 42.02,33.58 C1.2
N$2
  pour Top (no thermals): 38.2,29.77 38.2,24.64 arc90 38.84,24 41.56,24 arc90 42.2,24.64 42.2,29.77 arc90 41.56,30.4 38.84,30.4 arc90
N$3
  Top 0.305: U2.5 37.95,3.2 C7.2
N$7
  Top 0.203: C11.2 37.45,8.25 36.95,7.75 U2.10
N$8
  Top 0.203: C11.1 39.15,8.45 38.5,7.8 37.8,7.8 37.45,7.45 U2.9
N$43  (via drill 0.3)
  Top 0.203: R4.1 52.12,34.67 Q1.3 52.2,29.95 v52.2,29.1 | U1.5 v42.66,29.4
  Bottom 0.203: v42.66,29.4 U1.5 43.2,30.6 51.6,30.6 52.2,30 v52.2,29.1
TP_INT  (via drill 0.3)  (1 unrouted)
  Top 0.203: J1.06 4.37,27.4 6,27.4 R6.1 | R6.2 16,37.4 v22.4,37.4 22.7,37.1 J5.15 | J6.6 v51.75,13.9 | v29,38 v23.6,38
  Bottom 0.203: v29,38 31.8,38 51.75,18.05 v51.75,13.9 | v23.6,38 23,38 v22.4,37.4
TP_RESET  (via drill 0.3)  (1 unrouted)
  Top 0.203: J1.07 12.82,35.85 R8.1 | R8.2 15,38 22.7,38 23.3,37.4 | J6.4 v50.75,13.9 | v32.9,34.7 32.5,35.1 32.5,36.1 31.3,37.3 28.7,37.3 28.4,37.6 24.9,37.6 24.7,37.4 23.3,37.4 | J5.17 23.3,37.4
  Bottom 0.203: v50.75,13.9 50.75,16.85 v32.9,34.7
VCC_A_3V3  (via drill 0.3)
  Top 0.203: J6.5 v51.25,14.4
  Top 0.305: J5.9 20.9,35.1 v21.2,34.8 J5.10 | J5.39 v29.9,35.6 | VCC_A_3V3.TP v13.6,27 | J5.16 23,33.9 22.7,34.2 v22.1,34.2
  Top 0.61: VCC_A_3V3.TP 11.59,23.59 J1.03
  Route2 0.305: v29.9,35.6 27.7,37.8 24.2,37.8 22.9,36.5 22.9,35 v22.1,34.2 21.8,34.2 v21.2,34.8 19,34.8 13.6,29.4 v13.6,27
  Bottom 0.203: 51.25,14.5 v51.25,14.4
  Bottom 0.305: v29.9,35.6 33,35.6 51.25,17.35 51.25,14.5
VCC_LEDA_NC
  Top 0.305: J5.1 18.5,35.1 18.8,34.8 J5.2
VCC_LEDK_NC
  Top 0.305: J5.6 20,34.9 19.7,35.2 J5.5

### Text on the board
tPlace: RST | INT | SDA | MIPI LCD Connector / --> To Radxa CM5 IO | GND | RST | PWM | INT | SDA | SCL | Backlight Boost | SCL | 3V3 | TPS61160ADRT | NC | GND | J4 | HX8394F | Touch Driver: / Goodix GT1151QM | LCD: KLD35176BVIC | J3
tNames: Radxa CM5 IO | MIPI 2 Lane 3.5 Inch Prototyping | Retro Flip CM5